# Altium project os-solar.PrjPcb
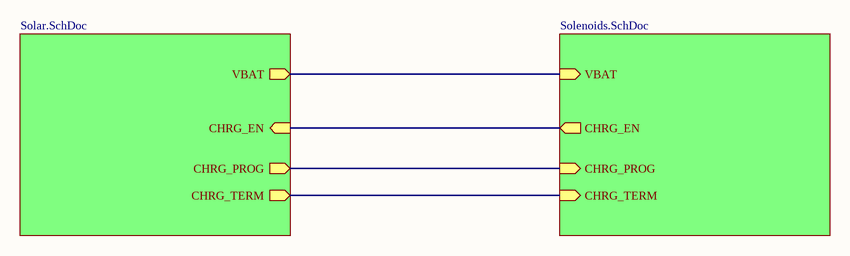
[diagram p0: os-solar.SchDoc]
3 sheets, 133 parts. Net scope: hierarchical (ports join the sheet entries above them; power ports are global).
Board file: os-solar.PcbDoc
Sheets:
  os-solar.SchDoc
    Designator = Solar.SchDoc
    Designator = Solenoids.SchDoc

## Sheet os-solar.SchDoc: OS-Solar
size A3; CompanyName: Kaasa5; DrawnBy: Nathan Kuchel; Organization: Kaasa5; Revision: 1.0.0; SheetNumber: 1; SheetTotal: 4; SheetTitle: Top Level

### Sub-sheets
Designator = Solar.SchDoc: VBAT (out), CHRG_PROG (out), CHRG_TERM (out), CHRG_EN (in)
Designator = Solenoids.SchDoc: VBAT (in), CHRG_PROG (in), CHRG_EN (out), CHRG_TERM (in)

### Nets
VBAT: sheet Designator/VBAT, sheet Designator/VBAT
CHRG_EN: sheet Designator/CHRG_EN, sheet Designator/CHRG_EN
CHRG_PROG: sheet Designator/CHRG_PROG, sheet Designator/CHRG_PROG
CHRG_TERM: sheet Designator/CHRG_TERM, sheet Designator/CHRG_TERM

### Notes on the sheet
- Project:
- Variant:
- Title:
- File:
- Drawn By:
- Print Date:
- Size:
- A3
- Master:
- Approved By:
- Sheet
- Revision
- Date:
- of
- Copyright © 2018 KAASA5

## Sheet Solar.SchDoc: OS-Solar
size A3; CompanyName: Kaasa5; DrawnBy: Nathan Kuchel; Organization: Kaasa5; Revision: 1.0.0; SheetNumber: 2; SheetTotal: 3; SheetTitle: Solar
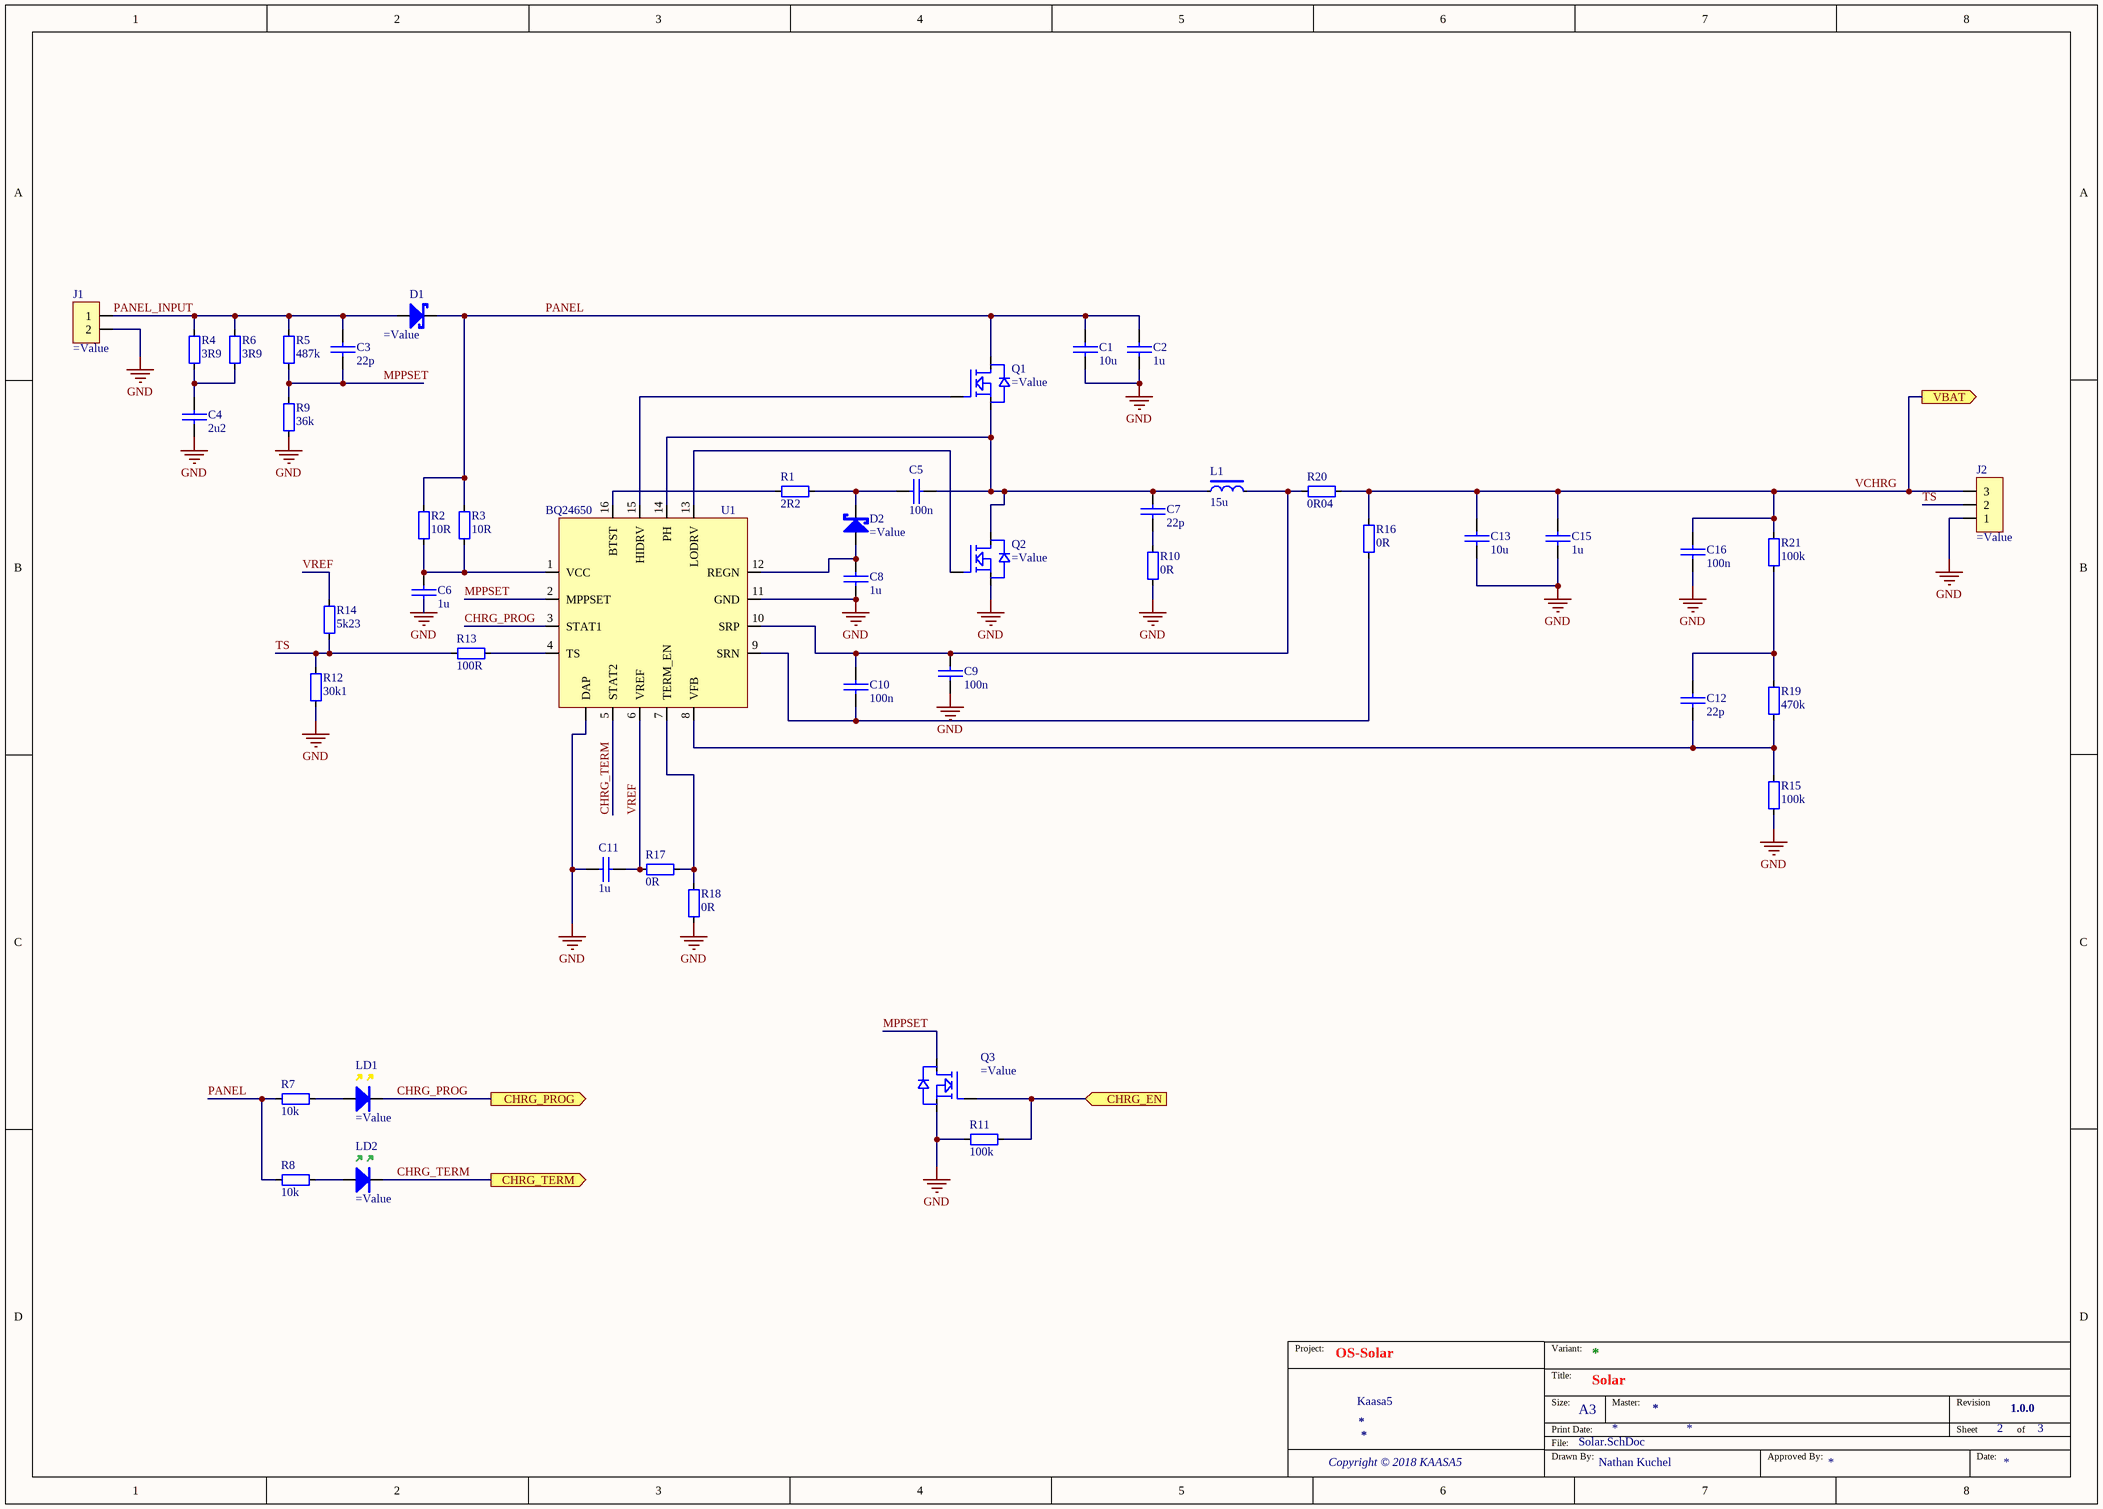
[diagram p1: Solar.SchDoc]

### Parts
C1  10u  [CAPC3216X18N]
C2  1u  [CAPC1608X09N]
C3  22p  [CAPC1608X09N]
C4  2u2  [CAPC2012X13N]
C5  100n  [CAPC1608X09N]
C6  1u  [CAPC1608X09N]
C7  22p  [CAPC1608X09N]
C8  1u  [CAPC1608X09N]
C9  100n  [CAPC1608X09N]
C10  100n  [CAPC1608X09N]
C11  1u  [CAPC1608X09N]
C12  22p  [CAPC1608X09N]
C13  10u  [CAPC3216X18N]
C15  1u  [CAPC1608X09N]
C16  100n  [CAPC1608X09N]
D1  (no value)  [DIOSMCX25N]
D2  (no value)  [DIOSMBX25N]
J1  (no value)  [HDR1X2_350_RA]
J2  (no value)  [HDR1X3_350_RA]
L1  15u  [INDP5050X28N]
LD1  (no value)  [LEDC1608X06N-YELLOW]
LD2  (no value)  [LEDC1608X06N-GREEN]
Q1  (no value)  [SOT95P230X110-3N]
Q2  (no value)  [SOT95P230X110-3N]
Q3  (no value)  [SOT95P230X110-3N]
R1  2R2  [RESC1608X06N]
R2  10R  [RESC1608X06N]
R3  10R  [RESC1608X06N]
R4  3R9  [RESC1608X06N]
R5  487k  [RESC1608X06N]
R6  3R9  [RESC1608X06N]
R7  10k  [RESC1608X06N]
R8  10k  [RESC1608X06N]
R9  36k  [RESC1608X06N]
R10  0R  [RESC1608X06N]
R11  100k  [RESC1608X06N]
R12  30k1  [RESC1608X06N]
R13  100R  [RESC1608X06N]
R14  5k23  [RESC1608X06N]
R15  100k  [RESC1608X06N]
R16  0R  [RESC1608X06N]
R17  0R  [RESC1608X06N]
R18  0R  [RESC1608X06N]
R19  470k  [RESC1608X06N]
R20  0R04  [RESC3216X07N]
R21  100k  [RESC1608X06N]
U1  BQ24650  [QFN50P350X350X90-16N]

### Ports
CHRG_EN (in), CHRG_PROG (out), CHRG_TERM (out), VBAT (out)

### Nets
GND: C1.2 C2.2 C4.2 C6.2 C8.2 C9.2 C11.1 C13.2 C15.2 C16.2 J1.2 J2.1 Q2.2(S) Q3.2(S) R9.1 R10.1 R11.1 R12.1 R15.1 R18.1 U1.11(GND) U1.DAP  [project net DGND]
VCHRG: C13.1 C15.1 C16.1 J2.3 R16.2 R20.2 R21.2 ; port VBAT  [project net VBAT]
CHRG_EN: Q3.1(G) R11.2 ; port CHRG_EN
CHRG_PROG: LD1.2(K) U1.3(STAT1) ; port CHRG_PROG
CHRG_TERM: LD2.2(K) U1.5(STAT2) ; port CHRG_TERM
MPPSET: C3.2 Q3.3(D) R5.1 R9.2 U1.2(MPPSET)
PANEL: C1.1 C2.1 D1.2(K) Q1.3(D) R2.2 R3.2 R7.1 R8.1
PANEL_INPUT: C3.1 D1.1(A) J1.1 R4.2 R5.2 R6.2
TS: J2.2 R12.2 R13.1 R14.1
VREF: C11.2 R14.2 R17.2 U1.6(VREF)
NetC4_1: C4.1 R4.1 R6.1
NetC5_1: C5.1 D2.2(K) R1.2
NetC5_2: C5.2 C7.1 L1.1 Q1.2(S) Q2.3(D) U1.14(PH)
NetC6_1: C6.1 R2.1 R3.1 U1.1(VCC)
NetC7_2: C7.2 R10.2
NetC8_1: C8.1 D2.1(A) U1.12(REGN)
NetC9_1: C9.1 C10.1 L1.2 R20.1 U1.10(SRP)
NetC10_2: C10.2 R16.1 U1.9(SRN)
NetC12_1: C12.1 R19.2 R21.1
NetC12_2: C12.2 R15.2 R19.1 U1.8(VFB)
NetLD1_1: LD1.1(A) R7.2
NetLD2_1: LD2.1(A) R8.2
NetQ1_1: Q1.1(G) U1.15(HIDRV)
NetQ2_1: Q2.1(G) U1.13(LODRV)
NetR1_1: R1.1 U1.16(BTST)
NetR13_2: R13.2 U1.4(TS)
NetR17_1: R17.1 R18.2 U1.7(TERM_EN)

### Notes on the sheet
- Project:
- Variant:
- Title:
- File:
- Drawn By:
- Print Date:
- Size:
- A3
- Master:
- Approved By:
- Sheet
- Revision
- Date:
- of
- Copyright © 2018 KAASA5

### Library data of the parts
C1 C13 = 68: CAP SMD CER X7R 10% 50V 1206 (3216 Metric); Manufacturer: Samsung Electro-Mechanics; Part Number: CL31B106KBHNNNE; PartId: 68; Value: 10u; ComponentLink1Description: Datasheet; ComponentLink1URL: https://media.digikey.com/pdf/Data%20Sheets/Samsung%20PDFs/CL_Series_MLCC_ds.pdf; Supplier 1: DigiKey; Supplier Part Number 1: 1276-6767-1-ND; Price: 0.39; PartStatus: Standard
C2 = 69: CAP SMD CER X7R 10% 50V 0805 (2012 Metric); Manufacturer: Yageo; Part Number: CC0805KKX7R9BB105; PartId: 69; Value: 1u; ComponentLink1Description: Datasheet; ComponentLink1URL: https://www.yageo.com/upload/media/product/productsearch/datasheet/mlcc/UPY-GPHC_X7R_6.3V-to-50V_18.pdf; Supplier 1: DigiKey; Supplier Part Number 1: 311-1886-1-ND; Price: 0.277; PartStatus: Standard
C3 C7 C12 = 79: CAP SMD CER C0G/NPO 5% 50V 0603 (1608 Metric); Manufacturer: Yageo; Part Number: CC0603JRNPO9BN220; PartId: 79; Value: 22p; ComponentLink1Description: Datasheet; ComponentLink1URL: https://www.yageo.com/upload/media/product/productsearch/datasheet/mlcc/UPY-GP_NP0_16V-to-50V_18.pdf; Supplier 1: DigiKey; Supplier Part Number 1: 311-1062-1-ND; Price: 0.037; PartStatus: Standard
C4 = 67: CAP SMD CER X7R 10% 35V 0805 (2012 Metric); Manufacturer: Taiyo Yuden; Part Number: UMK212BB7225KG-T; PartId: 67; Value: 2u2; ComponentLink1Description: Datasheet; ComponentLink1URL: https://ds.yuden.co.jp/TYCOMPAS/ut/specSheet?pn=UMK212BB7225KG-T++; Supplier 1: DigiKey; Supplier Part Number 1: 587-3169-1-ND; Price: 0.381; PartStatus: Standard
C5 C9 C10 C16 = 65: CAP SMD CER X7R 10% 50V 0603 (1608 Metric); Manufacturer: Yageo; Part Number: CC0603KRX7R9BB104; PartId: 65; Value: 100n; ComponentLink1Description: Datasheet; ComponentLink1URL: https://www.yageo.com/upload/media/product/productsearch/datasheet/mlcc/UPY-GPHC_X7R_6.3V-to-50V_18.pdf; Supplier 1: DigiKey; Supplier Part Number 1: 311-1344-1-ND; Price: 0.0524; PartStatus: Standard
C6 C8 C11 C15 = 66: CAP SMD CER X7R 10% 25V 0603 (1608 Metric); Manufacturer: Yageo; Part Number: CC0603KRX7R8BB105; PartId: 66; Value: 1u; ComponentLink1Description: Datasheet; ComponentLink1URL: https://www.yageo.com/upload/media/product/productsearch/datasheet/mlcc/UPY-GPHC_X7R_6.3V-to-50V_18.pdf; Supplier 1: DigiKey; Supplier Part Number 1: 311-1802-1-ND; Price: 0.285; PartStatus: Standard
D1 = 58: DIODE SMD SCHOTTKY 40V 3A SMC; Manufacturer: ON Semiconductor; Value: MBRS340T3G; PartId: 58; Part Number: MBRS340T3G; ComponentLink1Description: Datasheet; ComponentLink1URL: https://www.onsemi.com/pub/Collateral/MBRS340T3-D.PDF; Supplier 1: DigiKey; Supplier Part Number 1: MBRS340T3GOSCT-ND; Price: 0.68; PartStatus: Standard
D2 = 59: DIODE SMD SCHOTTKY 40V 2A SMB; Manufacturer: ON Semiconductor; Value: MBRS240LT3G; PartId: 59; Part Number: MBRS240LT3G; ComponentLink1Description: Datasheet; ComponentLink1URL: https://www.onsemi.com/pub/Collateral/MBRS240LT3-D.PDF; Supplier 1: DigiKey; Supplier Part Number 1: MBRS240LT3GOSCT-ND; Price: 0.4; PartStatus: Standard
J1 = 107: CON THRU RIGHT ANGLE 8A 300V Header 1x2pin; Manufacturer: Molex, LLC; Value: 0395021002; PartId: 107; Part Number: 0395021002; ComponentLink1Description: Datasheet; ComponentLink1URL: https://www.molex.com/pdm_docs/sd/395021002_sd.pdf; Supplier 1: DigiKey; Supplier Part Number 1: WM7770-ND; Price: 0.84; PartStatus: Standard
J2 = 108: CON THRU RIGHT ANGLE 8A 300V Header 1x3pin; Manufacturer: Molex, LLC; Value: 0395021003; PartId: 108; Part Number: 0395021003; ComponentLink1Description: Datasheet; ComponentLink1URL: https://www.molex.com/pdm_docs/sd/395021002_sd.pdf; Supplier 1: DigiKey; Supplier Part Number 1: WM7771-ND; Price: 1.13; PartStatus: Standard
L1 = 120: IND SMD Shielded W/W 20% 1.37A 100mOhm 5028; Manufacturer: Bourns Inc.; Part Number: SRR5028-150Y; PartId: 120; Value: 15u; ComponentLink1Description: Datasheet; ComponentLink1URL: https://www.bourns.com/docs/Product-Datasheets/SRR5028.pdf; Supplier 1: DigiKey; Supplier Part Number 1: 118-SRR5028-150YCT-ND; Price: 1.1; PartStatus: Standard; Supplier 2: Mouser; Supplier Part Number 2: 652-SRR5028-150Y
LD1 = 103: LED SMD YELLOW 180mcd Max 0603 (1608 Metric); Manufacturer: Lite-On Inc.; Value: LTST-C191KSKT; PartId: 103; Part Number: LTST-C191KSKT; ComponentLink1Description: Datasheet; ComponentLink1URL: https://optoelectronics.liteon.com/upload/download/DS22-2000-224/LTST-C191KSKT.PDF; Supplier 1: DigiKey; Supplier Part Number 1: 160-1448-1-ND; Price: 0.295; PartStatus: Standard
LD2 = 104: LED SMD GREEN 71mcd Max 0603 (1608 Metric); Manufacturer: Lite-On Inc.; Value: LTST-C191KGKT; PartId: 104; Part Number: LTST-C191KGKT; ComponentLink1Description: Datasheet; ComponentLink1URL: https://optoelectronics.liteon.com/upload/download/DS22-2000-228/LTST-C191KGKT.PDF; Supplier 1: DigiKey; Supplier Part Number 1: 160-1446-1-ND; Price: 0.278; PartStatus: Standard
Q1 Q2 = 51: TRANS MOSFET N-Channel 30V 5.6A 32mOhm SOT23; Manufacturer: Diodes Incorporated; Value: DMN3042L-7; PartId: 51; Part Number: DMN3042L-7; ComponentLink1Description: Datasheet; ComponentLink1URL: https://www.diodes.com/assets/Datasheets/DMN3042L.pdf; Supplier 1: DigiKey; Supplier Part Number 1: DMN3042L-7DICT-ND; Price: 0.6; PartStatus: Standard
Q3 = 27: TRANS MOSFET N-Channel 60V 360mA SOT23; Manufacturer: Nexperia USA Inc.; Value: 2N7002P,235; PartId: 27; Part Number: 2N7002P,235; ComponentLink1Description: Datasheet; ComponentLink1URL: https://assets.nexperia.com/documents/data-sheet/2N7002P.pdf; Supplier 1: DigiKey; Supplier Part Number 1: 1727-1865-1-ND; Price: 0.244; PartStatus: Standard
R1 = 71: RES SMD Think Film 1% 1/10W 150V 0603 (1608 Metric); Manufacturer: Yageo; Part Number: RC0603FR-072R2L; PartId: 71; Value: 2R2; ComponentLink1Description: Datasheet; ComponentLink1URL: https://www.yageo.com/upload/media/product/productsearch/datasheet/rchip/PYu-RC_Group_51_RoHS_L_11.pdf; Supplier 1: DigiKey; Supplier Part Number 1: 311-2.2HRCT-ND; Price: 0.0264; PartStatus: Standard
R2 R3 = 64: RES SMD Think Film 1% 1/10W 150V 0603 (1608 Metric); Manufacturer: Yageo; Part Number: RC0603FR-0710RL; PartId: 64; Value: 10R; ComponentLink1Description: Datasheet; ComponentLink1URL: https://www.yageo.com/upload/media/product/productsearch/datasheet/rchip/PYu-RC_Group_51_RoHS_L_11.pdf; Supplier 1: DigiKey; Supplier Part Number 1: 311-10.0HRCT-ND; Price: 0.0264; PartStatus: Standard
R4 R6 = 63: RES SMD Think Film 1% 1/10W 150V 0603 (1608 Metric); Manufacturer: Yageo; Part Number: RC0603FR-073R9L; PartId: 63; Value: 3R9; ComponentLink1Description: Datasheet; ComponentLink1URL: https://www.yageo.com/upload/media/product/productsearch/datasheet/rchip/PYu-RC_Group_51_RoHS_L_11.pdf; Supplier 1: DigiKey; Supplier Part Number 1: 13-RC0603FR-073R9LCT-ND; Price: 0.0034; PartStatus: Standard
R5 = 83: RES SMD Think Film 1% 1/10W 150V 0603 (1608 Metric); Manufacturer: Yageo; Part Number: RC0603FR-07487KL; PartId: 83; Value: 487k; ComponentLink1Description: Datasheet; ComponentLink1URL: https://www.yageo.com/upload/media/product/productsearch/datasheet/rchip/PYu-RC_Group_51_RoHS_L_11.pdf; Supplier 1: DigiKey; Supplier Part Number 1: 311-487KHRCT-ND; Price: 0.0131; PartStatus: Standard
R7 R8 = 97: RES SMD Think Film 1% 1/10W 150V 0603 (1608 Metric); Manufacturer: Yageo; Part Number: RC0603FR-0710KL; PartId: 97; Value: 10k; ComponentLink1Description: Datasheet; ComponentLink1URL: https://www.yageo.com/upload/media/product/productsearch/datasheet/rchip/PYu-RC_Group_51_RoHS_L_11.pdf; Supplier 1: DigiKey; Supplier Part Number 1: 311-10.0KHRCT-ND; Price: 0.013; PartStatus: Standard
R9 = 84: RES SMD Think Film 1% 1/10W 150V 0603 (1608 Metric); Manufacturer: Yageo; Part Number: RC0603FR-0736KL; PartId: 84; Value: 36k; ComponentLink1Description: Datasheet; ComponentLink1URL: https://www.yageo.com/upload/media/product/productsearch/datasheet/rchip/PYu-RC_Group_51_RoHS_L_11.pdf; Supplier 1: DigiKey; Supplier Part Number 1: 311-36.0KHRCT-ND; Price: 0.0131; PartStatus: Standard
R10 R16-R18 = 72: RES SMD Think Film 1% 1/10W 1A 0603 (1608 Metric); Manufacturer: Yageo; Part Number: RC0603FR-070RL; PartId: 72; Value: 0R; ComponentLink1Description: Datasheet; ComponentLink1URL: https://www.yageo.com/upload/media/product/productsearch/datasheet/rchip/PYu-RC_Group_51_RoHS_L_11.pdf; Supplier 1: DigiKey; Supplier Part Number 1: 311-0.0HRCT-ND; Price: 0.0118; PartStatus: Standard
R11 R15 R21 = 73: RES SMD Think Film 1% 1/10W 150V 0603 (1608 Metric); Manufacturer: Yageo; Part Number: RC0603FR-07100KL; PartId: 73; Value: 100k; ComponentLink1Description: Datasheet; ComponentLink1URL: https://www.yageo.com/upload/media/product/productsearch/datasheet/rchip/PYu-RC_Group_51_RoHS_L_11.pdf; Supplier 1: DigiKey; Supplier Part Number 1: 311-100KHRCT-ND; Price: 0.0131; PartStatus: Standard
R12 = 82: RES SMD Think Film 1% 1/10W 150V 0603 (1608 Metric); Manufacturer: Yageo; Part Number: RC0603FR-0730K1L; PartId: 82; Value: 30k1; ComponentLink1Description: Datasheet; ComponentLink1URL: https://www.yageo.com/upload/media/product/productsearch/datasheet/rchip/PYu-RC_Group_51_RoHS_L_11.pdf; Supplier 1: DigiKey; Supplier Part Number 1: 311-30.1KHRCT-ND; Price: 0.0131; PartStatus: Standard
R13 = 80: RES SMD Think Film 1% 1/10W 150V 0603 (1608 Metric); Manufacturer: Yageo; Part Number: RC0603FR-07100RL; PartId: 80; Value: 100R; ComponentLink1Description: Datasheet; ComponentLink1URL: https://www.yageo.com/upload/media/product/productsearch/datasheet/rchip/PYu-RC_Group_51_RoHS_L_11.pdf; Supplier 1: DigiKey; Supplier Part Number 1: 311-100HRCT-ND; Price: 0.0131; PartStatus: Standard
R14 = 81: RES SMD Think Film 1% 1/10W 150V 0603 (1608 Metric); Manufacturer: Yageo; Part Number: RC0603FR-075K23L; PartId: 81; Value: 5k23; ComponentLink1Description: Datasheet; ComponentLink1URL: https://www.yageo.com/upload/media/product/productsearch/datasheet/rchip/PYu-RC_Group_51_RoHS_L_11.pdf; Supplier 1: DigiKey; Supplier Part Number 1: 311-5.23KHRCT-ND; Price: 0.0131; PartStatus: Standard
R19 = 74: RES SMD Think Film 1% 1/10W 150V 0603 (1608 Metric); Manufacturer: Yageo; Part Number: RC0603FR-07470KL; PartId: 74; Value: 470k; ComponentLink1Description: Datasheet; ComponentLink1URL: https://www.yageo.com/upload/media/product/productsearch/datasheet/rchip/PYu-RC_Group_51_RoHS_L_11.pdf; Supplier 1: DigiKey; Supplier Part Number 1: 311-470KHRCT-ND; Price: 0.0131; PartStatus: Standard
R20 = 76: RES SMD Metal Strip 1% 1/2W 35ppm 1206 (3216 Metric); Manufacturer: Vishay Dale; Part Number: WSK1206R0400FEA18; PartId: 76; Value: 0R04; ComponentLink1Description: Datasheet; ComponentLink1URL: https://www.vishay.com/docs/30325/wsk120618.pdf; Supplier 1: DigiKey; Supplier Part Number 1: 541-2752-1-ND; Price: 1.3; PartStatus: Standard
U1 = 56: IC SMD SYNC SW-MODE BAT CHRGR MPPT 28V 600kHz QFN16; Manufacturer: Texas Instruments; Value: BQ24650RVAR; PartId: 56; Part Number: BQ24650RVAR; ComponentLink1Description: Datasheet; ComponentLink1URL: https://www.ti.com/lit/ds/symlink/bq24650.pdf?HQS=TI-null-null-digikeymode-df-pf-null-wwe&ts=1596968988143; Supplier 1: DigiKey; Supplier Part Number 1: 296-46287-1-ND; Price: 6.78; PartStatus: Standard

## Sheet Solenoids.SchDoc: OS-Solar
size A3; CompanyName: Kaasa5; DrawnBy: Nathan Kuchel; Organization: Kaasa5; Revision: 1.0.0; SheetNumber: 4; SheetTotal: 4; SheetTitle: Solenoids
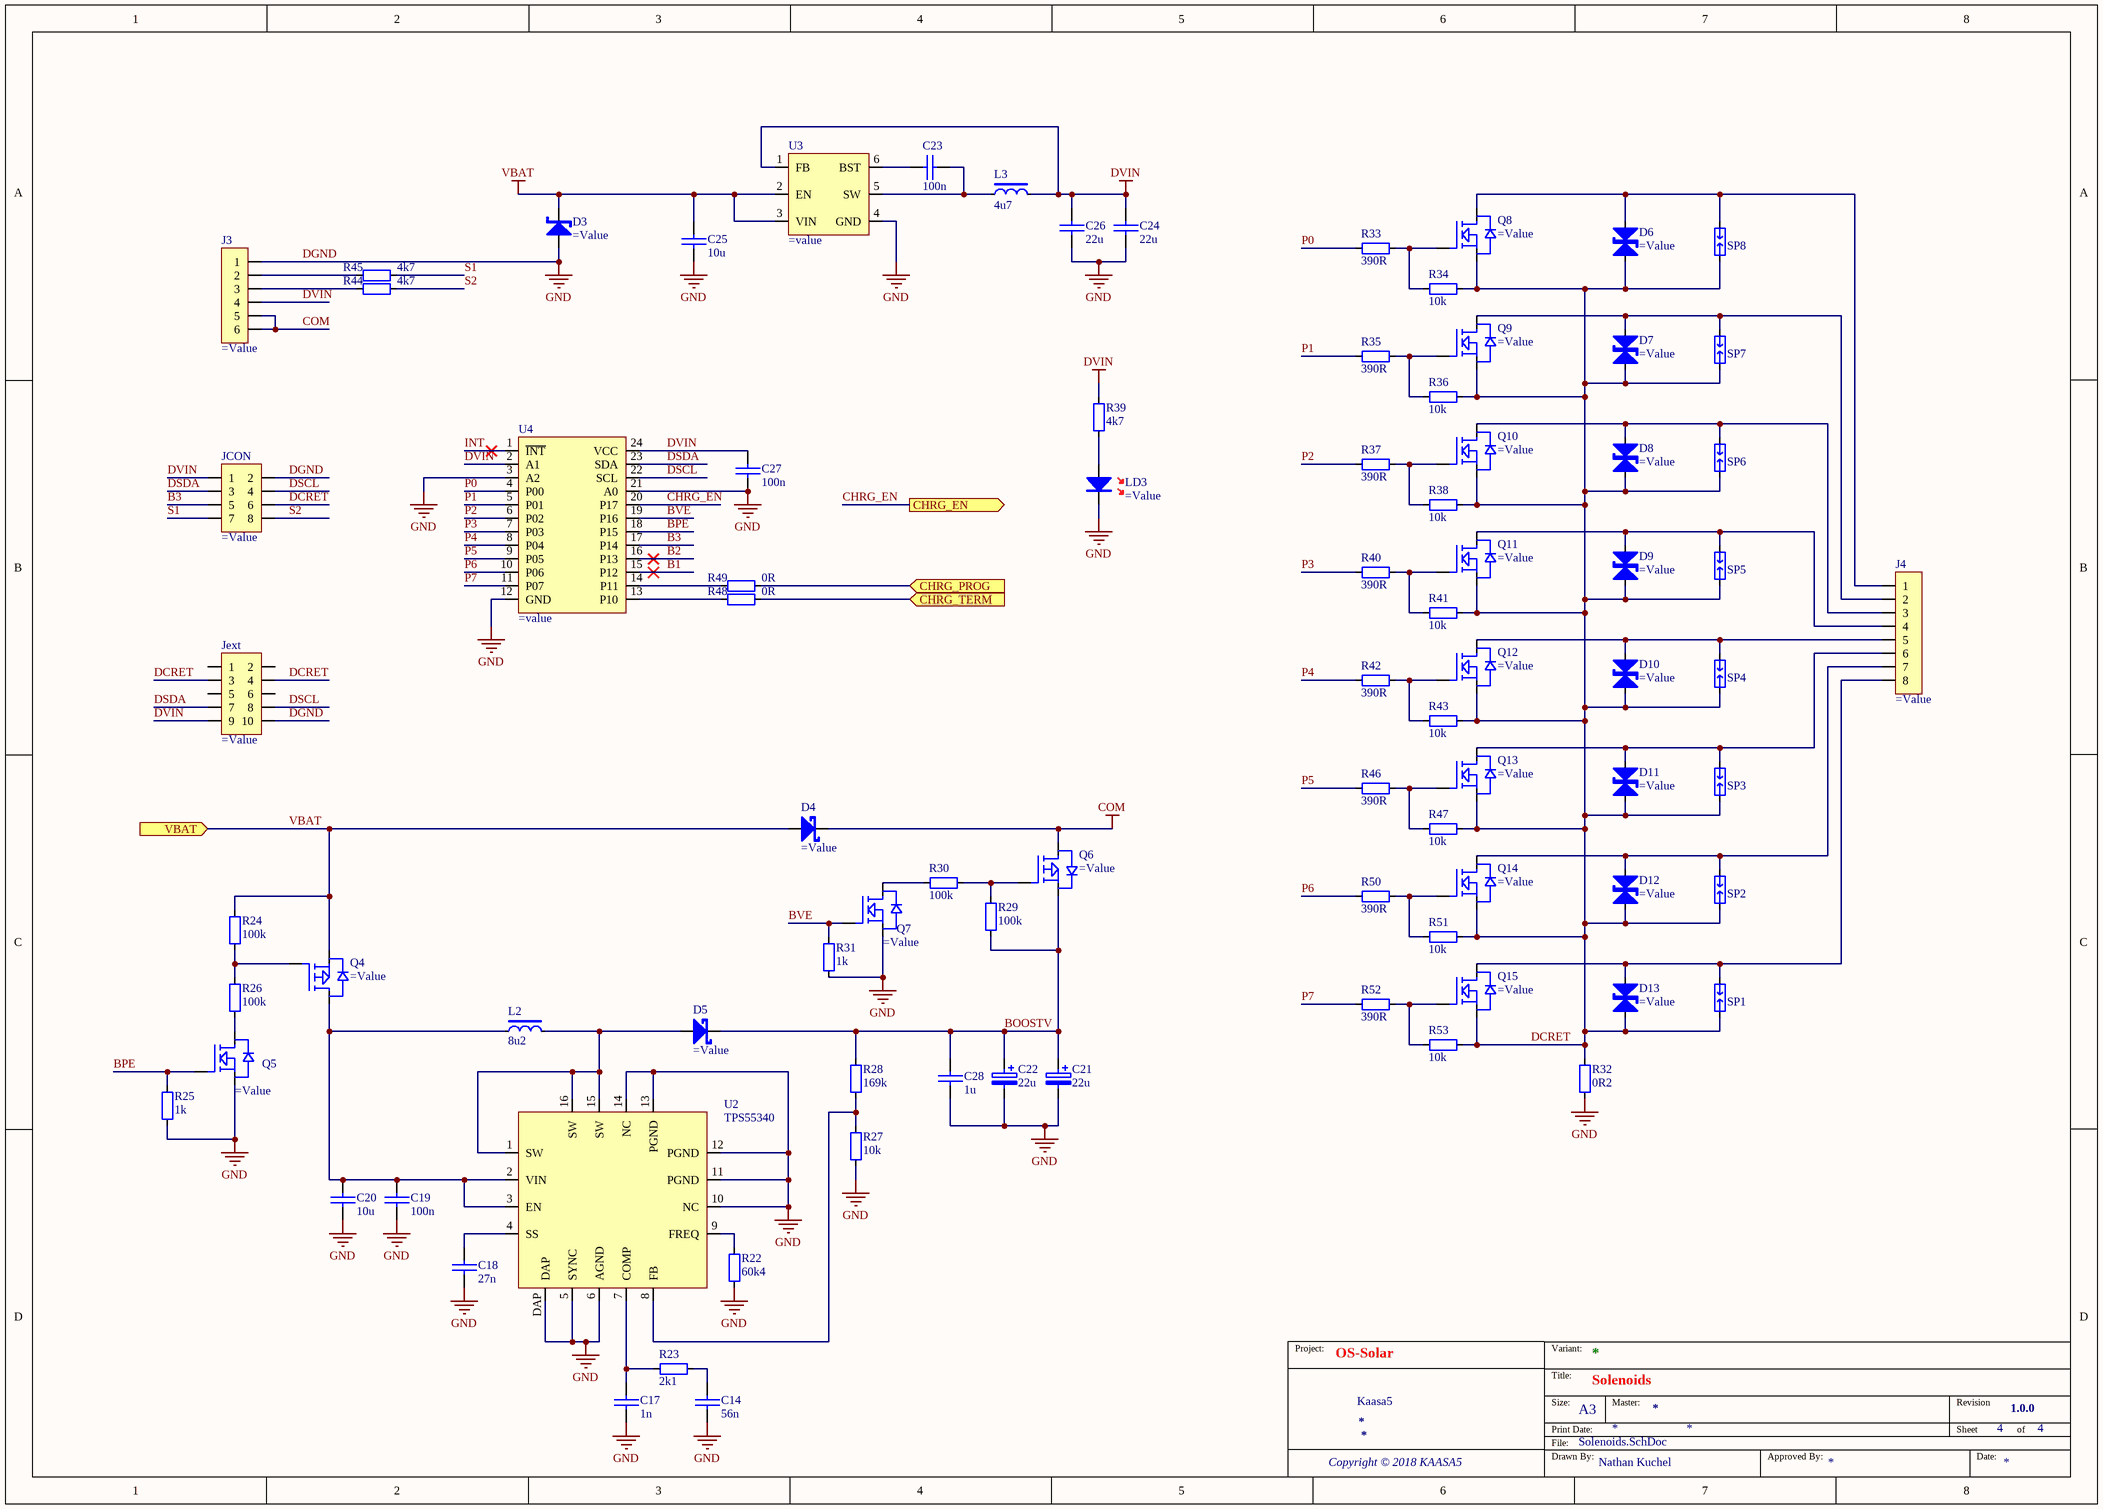
[diagram p2: Solenoids.SchDoc]

### Parts
C14  56n  [CAPC1608X09N]
C17  1n  [CAPC1608X09N]
C18  27n  [CAPC1608X09N]
C19  100n  [CAPC1608X09N]
C20  10u  [CAPC3216X18N]
C21  22u  [CAPAE630X600]
C22  22u  [CAPAE630X600]
C23  100n  [CAPC1608X09N]
C24  22u  [CAPC3216X18N]
C25  10u  [CAPC3216X18N]
C26  22u  [CAPC3216X18N]
C27  100n  [CAPC1608X09N]
C28  1u  [CAPC1608X09N]
D3  (no value)  [DIOSMBX25N]
D4  (no value)  [DIOSMCX25N]
D5  (no value)  [DIOSMCX25N]
D6  (no value)  [DIOSMBX25NB]
D7  (no value)  [DIOSMBX25NB]
D8  (no value)  [DIOSMBX25NB]
D9  (no value)  [DIOSMBX25NB]
D10  (no value)  [DIOSMBX25NB]
D11  (no value)  [DIOSMBX25NB]
D12  (no value)  [DIOSMBX25NB]
D13  (no value)  [DIOSMBX25NB]
J3  (no value)  [HDR1X6_350_RA]
J4  (no value)  [HDR1X8_350_RA]
JCON  (no value)  [HDR2X4]
Jext  (no value)  [HDR2X5RA]
L2  8u2  [INDP5553X51N]
L3  4u7  [INDP3030X15N]
LD3  (no value)  [LEDC1608X06N-RED]
Q4  (no value)  [SOT95P230X110-3N]
Q5  (no value)  [SOT95P230X110-3N]
Q6  (no value)  [SOT95P230X110-3N]
Q7  (no value)  [SOT95P230X110-3N]
Q8  (no value)  [SOT95P230X110-3N]
Q9  (no value)  [SOT95P230X110-3N]
Q10  (no value)  [SOT95P230X110-3N]
Q11  (no value)  [SOT95P230X110-3N]
Q12  (no value)  [SOT95P230X110-3N]
Q13  (no value)  [SOT95P230X110-3N]
Q14  (no value)  [SOT95P230X110-3N]
Q15  (no value)  [SOT95P230X110-3N]
R22  60k4  [RESC1608X06N]
R23  2k1  [RESC1608X06N]
R24  100k  [RESC1608X06N]
R25  1k  [RESC1608X06N]
R26  100k  [RESC1608X06N]
R27  10k  [RESC1608X06N]
R28  169k  [RESC1608X06N]
R29  100k  [RESC1608X06N]
R30  100k  [RESC1608X06N]
R31  1k  [RESC1608X06N]
R32  0R2  [RESC5025X06N]
R33  390R  [RESC1608X06N]
R34  10k  [RESC1608X06N]
R35  390R  [RESC1608X06N]
R36  10k  [RESC1608X06N]
R37  390R  [RESC1608X06N]
R38  10k  [RESC1608X06N]
R39  4k7  [RESC1608X06N]
R40  390R  [RESC1608X06N]
R41  10k  [RESC1608X06N]
R42  390R  [RESC1608X06N]
R43  10k  [RESC1608X06N]
R44  4k7  [RESC1608X06N]
R45  4k7  [RESC1608X06N]
R46  390R  [RESC1608X06N]
R47  10k  [RESC1608X06N]
R48  0R  [RESC1608X06N]
R49  0R  [RESC1608X06N]
R50  390R  [RESC1608X06N]
R51  10k  [RESC1608X06N]
R52  390R  [RESC1608X06N]
R53  10k  [RESC1608X06N]
SP1  0.15mm  [SPGAP-15]  (value not drawn)  (no BOM)
SP2  0.15mm  [SPGAP-15]  (value not drawn)  (no BOM)
SP3  0.15mm  [SPGAP-15]  (value not drawn)  (no BOM)
SP4  0.15mm  [SPGAP-15]  (value not drawn)  (no BOM)
SP5  0.15mm  [SPGAP-15]  (value not drawn)  (no BOM)
SP6  0.15mm  [SPGAP-15]  (value not drawn)  (no BOM)
SP7  0.15mm  [SPGAP-15]  (value not drawn)  (no BOM)
SP8  0.15mm  [SPGAP-15]  (value not drawn)  (no BOM)
U2  TPS55340  [QFN50P350X350X90-16N]
U3  (no value)  [SOT95P280X125-6N]
U4  (no value)  [TSOP65P640X120-24N]

### Ports
CHRG_EN (out), CHRG_PROG (in), CHRG_TERM (in), VBAT (in)

### Nets
COM: D4.2(K) J3.5 J3.6 Q6.3(D)
DGND: C14.2 C17.2 C18.2 C19.2 C20.2 C21.2 C22.2 C24.2 C25.2 C26.2 C27.2 C28.2 D3.1(A) J3.1 JCON.2 Jext.10 LD3.2(K) Q5.2(S) Q7.2(S) R22.1 R25.1 R27.1 R31.1 R32.1 U2.5(SYNC) U2.6(AGND) U2.10(NC) U2.11(PGND) U2.12(PGND) U2.13(PGND) U2.14(NC) U2.DAP U3.4(GND) U4.3(A2) U4.12(GND) U4.21(A0)  [also labelled GND]
DVIN: C24.1 C26.1 C27.1 J3.4 JCON.1 Jext.9 L3.2 R39.2 U3.1(FB) U4.2(A1) U4.24(VCC)
VBAT: C25.1 D3.2(K) D4.1(A) Q4.2(S) R24.2 U3.2(EN) U3.3(VIN) ; port VBAT
B1: U4.15(P12)
B2: U4.16(P13)
B3: JCON.5 U4.17(P14)
BOOSTV: C21.1 C22.1 C28.1 D5.2(K) Q6.2(S) R28.2 R29.1
BPE: Q5.1(G) R25.2 U4.18(P15)
BVE: Q7.1(G) R31.2 U4.19(P16)
CHRG_EN: U4.20(P17) ; port CHRG_EN
CHRG_PROG: R49.2 ; port CHRG_PROG
CHRG_TERM: R48.2 ; port CHRG_TERM
DCRET: D6.1(A1) D7.1(A1) D8.1(A1) D9.1(A1) D10.1(A1) D11.1(A1) D12.1(A1) D13.1(A1) JCON.6 Jext.3 Jext.4 Q8.2(S) Q9.2(S) Q10.2(S) Q11.2(S) Q12.2(S) Q13.2(S) Q14.2(S) Q15.2(S) R32.2 R34.2 R36.2 R38.2 R41.2 R43.2 R47.2 R51.2 R53.2 SP1.1 SP2.1 SP3.1 SP4.1 SP5.1 SP6.1 SP7.1 SP8.1
DSCL: JCON.4 Jext.8 U4.22(SCL)
DSDA: JCON.3 Jext.7 U4.23(SDA)
INT: U4.1(~{INT})
P0: R33.1 U4.4(P00)
P1: R35.1 U4.5(P01)
P2: R37.1 U4.6(P02)
P3: R40.1 U4.7(P03)
P4: R42.1 U4.8(P04)
P5: R46.1 U4.9(P05)
P6: R50.1 U4.10(P06)
P7: R52.1 U4.11(P07)
S1: JCON.7 R45.1
S2: JCON.8 R44.1
NetC14_1: C14.1 R23.1
NetC17_1: C17.1 R23.2 U2.7(COMP)
NetC18_1: C18.1 U2.4(SS)
NetC19_1: C19.1 C20.1 L2.2 Q4.3(D) U2.2(VIN) U2.3(EN)
NetC23_1: C23.1 U3.6(BST)
NetC23_2: C23.2 L3.1 U3.5(SW)
NetD5_1: D5.1(A) L2.1 U2.1(SW) U2.15(SW) U2.16(SW)
NetD6_2: D6.2(A2) J4.1 Q8.3(D) SP8.2
NetD7_2: D7.2(A2) J4.2 Q9.3(D) SP7.2
NetD8_2: D8.2(A2) J4.3 Q10.3(D) SP6.2
NetD9_2: D9.2(A2) J4.4 Q11.3(D) SP5.2
NetD10_2: D10.2(A2) J4.5 Q12.3(D) SP4.2
NetD11_2: D11.2(A2) J4.6 Q13.3(D) SP3.2
NetD12_2: D12.2(A2) J4.7 Q14.3(D) SP2.2
NetD13_2: D13.2(A2) J4.8 Q15.3(D) SP1.2
NetJ3_2: J3.2 R45.2
NetJ3_3: J3.3 R44.2
NetLD3_1: LD3.1(A) R39.1
NetQ4_1: Q4.1(G) R24.1 R26.2
NetQ5_3: Q5.3(D) R26.1
NetQ6_1: Q6.1(G) R29.2 R30.1
NetQ7_3: Q7.3(D) R30.2
NetQ8_1: Q8.1(G) R33.2 R34.1
NetQ9_1: Q9.1(G) R35.2 R36.1
NetQ10_1: Q10.1(G) R37.2 R38.1
NetQ11_1: Q11.1(G) R40.2 R41.1
NetQ12_1: Q12.1(G) R42.2 R43.1
NetQ13_1: Q13.1(G) R46.2 R47.1
NetQ14_1: Q14.1(G) R50.2 R51.1
NetQ15_1: Q15.1(G) R52.2 R53.1
NetR22_2: R22.2 U2.9(FREQ)
NetR27_2: R27.2 R28.1 U2.8(FB)
NetR48_1: R48.1 U4.13(P10)
NetR49_1: R49.1 U4.14(P11)

Not connected (* = marked no-connect by the designer): Jext 1 2 5 6

### Notes on the sheet
- Project:
- Variant:
- Title:
- File:
- Drawn By:
- Print Date:
- Size:
- A3
- Master:
- Approved By:
- Sheet
- Revision
- Date:
- of
- Copyright © 2018 KAASA5

### Library data of the parts
C14 = 117: CAP SMD CER X7R 5% 50V 0603 (1608 Metric); Manufacturer: AVX Corporation; Part Number: 06035C563JAT2A; PartId: 117; Value: 56n; ComponentLink1Description: Datasheet; ComponentLink1URL: http://datasheets.avx.com/X7RDielectric.pdf; Supplier 1: DigiKey; Supplier Part Number 1: 478-12729-1-ND; Price: 0.438; PartStatus: Standard
C17 = 116: CAP SMD CER C0G/NPO 5% 50V 0603 (1608 Metric); Manufacturer: Yageo; Part Number: CC0603JRNPO9BN102; PartId: 116; Value: 1n; ComponentLink1Description: Datasheet; ComponentLink1URL: https://www.yageo.com/upload/media/product/productsearch/datasheet/mlcc/UPY-GP_NP0_16V-to-50V_18.pdf; Supplier 1: DigiKey; Supplier Part Number 1: 311-1423-1-ND; Price: 0.053; PartStatus: Standard
C18 = 115: CAP SMD CER X7R 5% 50V 0603 (1608 Metric); Manufacturer: Yageo; Part Number: CC0603JRX7R9BB273; PartId: 115; Value: 27n; ComponentLink1Description: Datasheet; ComponentLink1URL: https://www.yageo.com/upload/media/product/productsearch/datasheet/mlcc/UPY-GPHC_X7R_6.3V-to-50V_18.pdf; Supplier 1: DigiKey; Supplier Part Number 1: 311-4012-1-ND; Price: 0.152; PartStatus: Standard
C19 C23 C27 = 65: as C5 on sheet Solar; PartId: 65; Value: 100n; ComponentLink1Description: Datasheet; ComponentLink1URL: https://www.yageo.com/upload/media/product/productsearch/datasheet/mlcc/UPY-GPHC_X7R_6.3V-to-50V_18.pdf; Supplier 1: DigiKey; Supplier Part Number 1: 311-1344-1-ND; Price: 0.0524; PartStatus: Standard
C20 C25 = 68: as C1 on sheet Solar; PartId: 68; Value: 10u; ComponentLink1Description: Datasheet; ComponentLink1URL: https://media.digikey.com/pdf/Data%20Sheets/Samsung%20PDFs/CL_Series_MLCC_ds.pdf; Supplier 1: DigiKey; Supplier Part Number 1: 1276-6767-1-ND; Price: 0.39; PartStatus: Standard
C21 C22 = 118: CAP SMD ELECTRO 20% 35V SMAE; Manufacturer: Panasonic Electronic Components; Part Number: 35SVPF22M; PartId: 118; Value: 22u; ComponentLink1Description: Datasheet; ComponentLink1URL: https://industrial.panasonic.com/ww/products/capacitors/polymer-capacitors/os-con/models/35SVPF22M; Supplier 1: DigiKey; Supplier Part Number 1: P16560CT-ND; Price: 1.63; PartStatus: Standard
C24 C26 = 102: CAP SMD CER X7R 10% 10V 1206 (3216 Metric); Manufacturer: Samsung Electro-Mechanics; Part Number: CL31B226KPHNNNE; PartId: 102; Value: 22u; ComponentLink1Description: Datasheet; ComponentLink1URL: https://media.digikey.com/pdf/Data%20Sheets/Samsung%20PDFs/CL_Series_MLCC_ds.pdf; Supplier 1: DigiKey; Supplier Part Number 1: 1276-2769-1-ND; Price: 0.492; PartStatus: Standard
C28 = 69: as C2 on sheet Solar; PartId: 69; Value: 1u; ComponentLink1Description: Datasheet; ComponentLink1URL: https://www.yageo.com/upload/media/product/productsearch/datasheet/mlcc/UPY-GPHC_X7R_6.3V-to-50V_18.pdf; Supplier 1: DigiKey; Supplier Part Number 1: 311-1886-1-ND; Price: 0.277; PartStatus: Standard
D3 = 106: DIODE SMD TVS 24V 600W SMB; Manufacturer: Littelfuse Inc.; Value: SMBJ24A; PartId: 106; Part Number: SMBJ24A; ComponentLink1Description: Datasheet; ComponentLink1URL: https://www.littelfuse.com/~/media/electronics/datasheets/tvs_diodes/littelfuse_tvs_diode_smbj_datasheet.pdf.pdf; Supplier 1: DigiKey; Supplier Part Number 1: SMBJ24ALFCT-ND; Price: 0.398; PartStatus: Standard
D4 D5 = 58: as D1 on sheet Solar; PartId: 58; Part Number: MBRS340T3G; ComponentLink1Description: Datasheet; ComponentLink1URL: https://www.onsemi.com/pub/Collateral/MBRS340T3-D.PDF; Supplier 1: DigiKey; Supplier Part Number 1: MBRS340T3GOSCT-ND; Price: 0.68; PartStatus: Standard
D6-D13 = 92: DIODE SMD TVS 24V 600W SMB; Manufacturer: Littelfuse Inc.; Value: SMBJ24CA; PartId: 92; Part Number: SMBJ24CA; ComponentLink1Description: Datasheet; ComponentLink1URL: https://www.littelfuse.com/~/media/electronics/datasheets/tvs_diodes/littelfuse_tvs_diode_smbj_datasheet.pdf.pdf; Supplier 1: DigiKey; Supplier Part Number 1: SMBJ24CALFCT-ND; Price: 0.376; PartStatus: Standard
J3 = 109: CON THRU RIGHT ANGLE 8A 300V Header 1x6pin; Manufacturer: Molex, LLC; Value: 0395021006; PartId: 109; Part Number: 0395021006; ComponentLink1Description: Datasheet; ComponentLink1URL: https://www.molex.com/pdm_docs/sd/395021002_sd.pdf; Supplier 1: DigiKey; Supplier Part Number 1: WM7774-ND; Price: 2.15; PartStatus: Standard
J4 = 110: CON THRU RIGHT ANGLE 8A 300V Header 1x8pin; Manufacturer: Molex, LLC; Value: 0395021008; PartId: 110; Part Number: 0395021008; ComponentLink1Description: Datasheet; ComponentLink1URL: https://www.molex.com/pdm_docs/sd/395021002_sd.pdf; Supplier 1: DigiKey; Supplier Part Number 1: WM7776-ND; Price: 2.85; PartStatus: Standard
JCON = 101: CON THRU VERTICAL 0.100" (2.54mm)  Header 2x4pin; Manufacturer: Amphenol Commercial Products; Value: 68602-208HLF; PartId: 101; Part Number: 68602-208HLF; ComponentLink1Description: Datasheet; ComponentLink1URL: https://www.digikey.com.au/product-detail/en/amphenol-icc-fci/68602-208HLF/609-3371-ND/1878505; Supplier 1: DigiKey; Supplier Part Number 1: 609-3371-ND; Price: 0.61; PartStatus: Standard
Jext = 95: CON THRU RIGHT ANGLE 2.54mm 3A 250V Header 2x5pin; Manufacturer: Wurth Electronics Inc; Value: 61201021721; PartId: 95; Part Number: 61201021721; ComponentLink1Description: Datasheet; ComponentLink1URL: https://media.digikey.com/pdf/Data%20Sheets/Wurth%20Electronics%20PDFs/Box%20Header_IDC%20Conn%20WR-BHD.pdf; Supplier 1: DigiKey; Supplier Part Number 1: 732-2098-ND; Price: 0.582; PartStatus: Standard
L2 = 119: IND SMD Shielded W/W 20% 60V 5.6A 31.75mOhm 5553; Manufacturer: Coilcraft; Part Number: XAL5050-822MEB; PartId: 119; Value: 8u2; ComponentLink1Description: Datasheet; ComponentLink1URL: https://www.coilcraft.com/getmedia/49bc46c8-4b2c-45b9-9b6c-2eaa235ea698/xal50xx.pdf; Supplier 1: Mouser; Supplier Part Number 1: 994-XAL5050-822MEB; Price: 3.6; PartStatus: Standard
L3 = 121: IND SMD Shielded W/W 20% 1.4A 167mOhm 3015; Manufacturer: Coilcraft; Part Number: EPL3015-472MLB; PartId: 121; Value: 4u7; ComponentLink1Description: Datasheet; ComponentLink1URL: https://www.coilcraft.com/getmedia/dceecf13-6ce7-45ee-92e2-a00566b63bbe/epl3015.pdf; Supplier 1: Mouser; Supplier Part Number 1: 994-EPL3015-472MLB; Price: 1.76; PartStatus: Standard
LD3 = 105: LED SMD RED 180mcd Max 0603 (1608 Metric); Manufacturer: Lite-On Inc.; Value: LTST-C191KRKT; PartId: 105; Part Number: LTST-C191KRKT; ComponentLink1Description: Datasheet; ComponentLink1URL: https://optoelectronics.liteon.com/upload/download/DS22-2000-223/LTST-C191KRKT.PDF; Supplier 1: DigiKey; Supplier Part Number 1: 160-1447-1-ND; Price: 0.278; PartStatus: Standard
Q4 Q6 = 52: TRANS MOSFET P-Channel -30V -4.3A 70mOhm SOT23; Manufacturer: Diodes Incorporated; Value: DMP3056L-7; PartId: 52; Part Number: DMP3056L-7; ComponentLink1Description: Datasheet; ComponentLink1URL: https://www.diodes.com/assets/Datasheets/DMP3056L.pdf; Supplier 1: DigiKey; Supplier Part Number 1: DMP3056L-7DICT-ND; Price: 0.57; PartStatus: Standard
Q5 Q7 = 27: as Q3 on sheet Solar; PartId: 27; Part Number: 2N7002P,235; ComponentLink1Description: Datasheet; ComponentLink1URL: https://assets.nexperia.com/documents/data-sheet/2N7002P.pdf; Supplier 1: DigiKey; Supplier Part Number 1: 1727-1865-1-ND; Price: 0.244; PartStatus: Standard
Q8-Q15 = 51: as Q1 on sheet Solar; PartId: 51; Part Number: DMN3042L-7; ComponentLink1Description: Datasheet; ComponentLink1URL: https://www.diodes.com/assets/Datasheets/DMN3042L.pdf; Supplier 1: DigiKey; Supplier Part Number 1: DMN3042L-7DICT-ND; Price: 0.6; PartStatus: Standard
R22 = 114: RES SMD Think Film 1% 1/10W 150V 0603 (1608 Metric); Manufacturer: Yageo; Part Number: RC0603FR-0760K4L; PartId: 114; Value: 60k4; ComponentLink1Description: Datasheet; ComponentLink1URL: https://www.yageo.com/upload/media/product/productsearch/datasheet/rchip/PYu-RC_Group_51_RoHS_L_11.pdf; Supplier 1: DigiKey; Supplier Part Number 1: 311-60.4KHRCT-ND; Price: 0.0123; PartStatus: Standard
R23 = 112: RES SMD Think Film 1% 1/10W 150V 0603 (1608 Metric); Manufacturer: Yageo; Part Number: RC0603FR-072K1L; PartId: 112; Value: 2k1; ComponentLink1Description: Datasheet; ComponentLink1URL: https://www.yageo.com/upload/media/product/productsearch/datasheet/rchip/PYu-RC_Group_51_RoHS_L_11.pdf; Supplier 1: DigiKey; Supplier Part Number 1: 311-2.10KHRCT-ND; Price: 0.0123; PartStatus: Standard
R24 R26 R29 R30 = 73: as R11 on sheet Solar; PartId: 73; Value: 100k; ComponentLink1Description: Datasheet; ComponentLink1URL: https://www.yageo.com/upload/media/product/productsearch/datasheet/rchip/PYu-RC_Group_51_RoHS_L_11.pdf; Supplier 1: DigiKey; Supplier Part Number 1: 311-100KHRCT-ND; Price: 0.0131; PartStatus: Standard
R25 R31 = 62: RES SMD Think Film 1% 1/10W 150V 0603 (1608 Metric); Manufacturer: Yageo; Part Number: RC0603FR-071KL; PartId: 62; Value: 1k; ComponentLink1Description: Datasheet; ComponentLink1URL: https://www.yageo.com/upload/media/product/productsearch/datasheet/rchip/PYu-RC_Group_51_RoHS_L_11.pdf; Supplier 1: DigiKey; Supplier Part Number 1: 311-1.00KHRCT-ND; Price: 0.0131; PartStatus: Standard
R27 R34 R36 R38 R41 R43 R47 R51 R53 = 97: as R7 on sheet Solar; PartId: 97; Value: 10k; ComponentLink1Description: Datasheet; ComponentLink1URL: https://www.yageo.com/upload/media/product/productsearch/datasheet/rchip/PYu-RC_Group_51_RoHS_L_11.pdf; Supplier 1: DigiKey; Supplier Part Number 1: 311-10.0KHRCT-ND; Price: 0.013; PartStatus: Standard
R28 = 113: RES SMD Think Film 1% 1/10W 150V 0603 (1608 Metric); Manufacturer: Yageo; Part Number: RC0603FR-07169KL; PartId: 113; Value: 169k; ComponentLink1Description: Datasheet; ComponentLink1URL: https://www.yageo.com/upload/media/product/productsearch/datasheet/rchip/PYu-RC_Group_51_RoHS_L_11.pdf; Supplier 1: DigiKey; Supplier Part Number 1: 311-169KHRCT-ND; Price: 0.0123; PartStatus: Standard
R32 = 99: RES SMD Metal Strip 1% 1/2W 75ppm/degC 2010 (5025 Metric); Manufacturer: Vishay Dale; Part Number: WSL2010R2000FEA; PartId: 99; Value: 0R2; ComponentLink1Description: Datasheet; ComponentLink1URL: https://www.vishay.com/docs/30100/wsl.pdf; Supplier 1: DigiKey; Supplier Part Number 1: WSLE-.20CT-ND; Price: 1.23; PartStatus: Standard
R33 R35 R37 R40 R42 R46 R50 R52 = 96: RES SMD Think Film 1% 1/10W 150V 0603 (1608 Metric); Manufacturer: Yageo; Part Number: RC0603FR-07390RL; PartId: 96; Value: 390R; ComponentLink1Description: Datasheet; ComponentLink1URL: https://www.yageo.com/upload/media/product/productsearch/datasheet/rchip/PYu-RC_Group_51_RoHS_L_11.pdf; Supplier 1: DigiKey; Supplier Part Number 1: 311-390HRCT-ND; Price: 0.013; PartStatus: Standard
R39 R44 R45 = 90: RES SMD Think Film 1% 1/10W 150V 0603 (1608 Metric); Manufacturer: Yageo; Part Number: RC0603FR-074K7L; PartId: 90; Value: 4k7; ComponentLink1Description: Datasheet; ComponentLink1URL: https://www.yageo.com/upload/media/product/productsearch/datasheet/rchip/PYu-RC_Group_51_RoHS_L_11.pdf; Supplier 1: DigiKey; Supplier Part Number 1: 311-4.70KHRCT-ND; Price: 0.0131; PartStatus: Standard
R48 R49 = 72: as R10 on sheet Solar; PartId: 72; Value: 0R; ComponentLink1Description: Datasheet; ComponentLink1URL: https://www.yageo.com/upload/media/product/productsearch/datasheet/rchip/PYu-RC_Group_51_RoHS_L_11.pdf; Supplier 1: DigiKey; Supplier Part Number 1: 311-0.0HRCT-ND; Price: 0.0118; PartStatus: Standard
SP1-SP8 = 98: SPARK GAP 1kV PCB; PartId: 98; Value: 0.15mm; Manufacturer: n/a; Part Number: n/a; ComponentLink1Description: None; ComponentLink1URL: n/a; Supplier 1: None; Supplier Part Number 1: n/a; Price: 0; PartStatus: Standard (No BOM)
U2 = 111: IC SMD SYNC BOOST CONV 5.25A QFN16; Manufacturer: Texas Instruments; Value: TPS55340RTER; PartId: 111; Part Number: TPS55340RTER; ComponentLink1Description: Datasheet; ComponentLink1URL: https://www.ti.com/lit/ds/symlink/tps55340.pdf; Supplier 1: DigiKey; Supplier Part Number 1: 296-37677-1-ND; Price: 4.71; PartStatus: Standard
U3 = 77: IC SMD SYNC BUCK CONV 5V 2A TSOT-23-6; Manufacturer: Diodes Incorporated; Value: AP63205WU-7; PartId: 77; Part Number: AP63205WU-7; ComponentLink1Description: Datasheet; ComponentLink1URL: https://www.diodes.com/assets/Datasheets/AP63200-AP63201-AP63203-AP63205.pdf; Supplier 1: DigiKey; Supplier Part Number 1: AP63205WU-7DICT-ND; Price: 1.21; PartStatus: Standard
U4 = 50: IC SMD I/O EXPANDER 16-BIT I2C TSSOP-24; Manufacturer: NXP Semiconductors; Value: PCA9555APW,118; PartId: 50; Part Number: PCA9555APW,118; ComponentLink1Description: Datasheet; ComponentLink1URL: https://www.nxp.com/docs/en/data-sheet/PCA9555A.pdf; Supplier 1: DigiKey; Supplier Part Number 1: 568-9919-1-ND; Price: 2.3; PartStatus: Standard

## Nets that join several sheets
DGND: Solar (22 pins), Solenoids (36 pins)
VBAT: Solar (7 pins), Solenoids (7 pins)
CHRG_EN: Solar (Q3.1 R11.2), Solenoids (U4.20)
CHRG_PROG: Solar (LD1.2 U1.3), Solenoids (R49.2)
CHRG_TERM: Solar (LD2.2 U1.5), Solenoids (R48.2)

## Assembly variants
Solar: not fitted J5 Jext R18